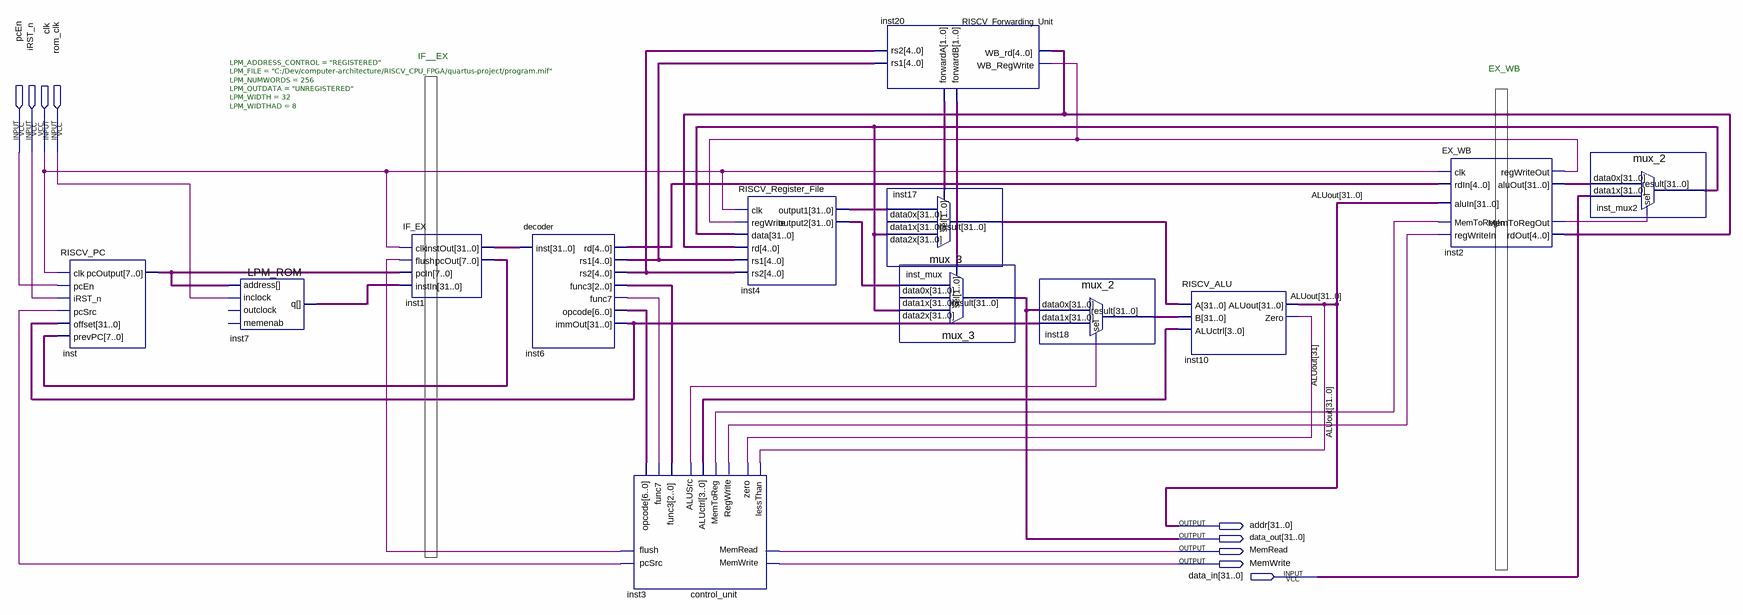
[diagram p0: schematic sheet]
// Quartus schematic CPU_pipelined.bdf as structural Verilog: 13 symbols, 9 pins
module CPU_pipelined (
  input  pcEn,
  input  iRST_n,
  input  clk,
  input  rom_clk,
  input  [31:0] data_in,
  output [31:0] addr,
  output [31:0] data_out,
  output MemRead,
  output MemWrite
);

  wire inst2_memtoregout, inst2_regwriteout, inst3_alusrc, inst3_flush, inst3_memtoreg, inst3_pcsrc,
       inst3_regwrite, inst6_func7, inst10_zero;
  wire [1:0] inst20_forwarda, inst20_forwardb;
  wire [2:0] inst6_func3;
  wire [3:0] inst3_aluctrl;
  wire [4:0] inst2_rdout, inst6_rd, inst6_rs1, inst6_rs2;
  wire [6:0] inst6_opcode;
  wire [7:0] inst1_pcout, inst_pcoutput;
  wire [31:0] inst1_instout, inst2_aluout, inst4_output1, inst4_output2, inst6_immout, inst7_q,
       inst17_result, inst18_result, inst_mux2_result;

  RISCV_PC inst (
    .clk(clk), .iRST_n(iRST_n), .pcSrc(inst3_pcsrc), .pcEn(pcEn), .offset(inst6_immout),
    .prevPC(inst1_pcout), .pcOutput(inst_pcoutput));
  LPM_ROM #(.LPM_ADDRESS_CONTROL("REGISTERED"), .LPM_FILE("C:/Dev/computer-architecture/RISCV_CPU_FPGA/quartus-project/program.mif"), .LPM_NUMWORDS(256), .LPM_OUTDATA("UNREGISTERED"), .LPM_WIDTH(32), .LPM_WIDTHAD(8)) inst7 (
    .address(inst_pcoutput), .inclock(rom_clk), .q(inst7_q));  // open: outclock, memenab
  IF_EX inst1 (
    .clk(clk), .flush(inst3_flush), .pcIn(inst_pcoutput), .instIn(inst7_q), .pcOut(inst1_pcout),
    .instOut(inst1_instout));
  decoder inst6 (
    .inst(inst1_instout), .rd(inst6_rd), .rs1(inst6_rs1), .rs2(inst6_rs2), .func3(inst6_func3),
    .func7(inst6_func7), .immOut(inst6_immout), .opcode(inst6_opcode));
  control_unit inst3 (
    .opcode(inst6_opcode), .func3(inst6_func3), .func7(inst6_func7), .zero(inst10_zero), .lessThan(addr[31]),
    .ALUctrl(inst3_aluctrl), .flush(inst3_flush), .pcSrc(inst3_pcsrc), .ALUSrc(inst3_alusrc),
    .RegWrite(inst3_regwrite), .MemToReg(inst3_memtoreg), .MemRead(MemRead), .MemWrite(MemWrite));
  RISCV_Register_File inst4 (
    .clk(clk), .regWrite(inst2_regwriteout), .data(inst_mux2_result), .rd(inst2_rdout), .rs1(inst6_rs1),
    .rs2(inst6_rs2), .output1(inst4_output1), .output2(inst4_output2));
  RISCV_Forwarding_Unit inst20 (
    .WB_RegWrite(inst2_regwriteout), .WB_rd(inst2_rdout), .rs1(inst6_rs1), .rs2(inst6_rs2),
    .forwardA(inst20_forwarda), .forwardB(inst20_forwardb));
  mux_3 inst17 (
    .data2x(inst_mux2_result), .data0x(inst4_output1), .sel(inst20_forwarda), .result(inst17_result));  // open: data1x
  mux_3 inst_mux (
    .data2x(inst_mux2_result), .data0x(inst4_output2), .sel(inst20_forwardb), .result(data_out));  // open: data1x
  mux_2 inst18 (.data1x(inst6_immout), .data0x(data_out), .sel(inst3_alusrc), .result(inst18_result));
  RISCV_ALU inst10 (.A(inst17_result), .B(inst18_result), .ALUctrl(inst3_aluctrl), .ALUout(addr), .Zero(inst10_zero));
  EX_WB inst2 (
    .regWriteIn(inst3_regwrite), .MemToRegIn(inst3_memtoreg), .clk(clk), .rdIn(inst6_rd), .aluIn(addr),
    .regWriteOut(inst2_regwriteout), .MemToRegOut(inst2_memtoregout), .rdOut(inst2_rdout),
    .aluOut(inst2_aluout));
  mux_2 inst_mux2 (.data1x(data_in), .data0x(inst2_aluout), .sel(inst2_memtoregout), .result(inst_mux2_result));

  // Other names for the same wires on the sheet: ALUout[31:0] = addr

  // Notes on the sheet:
  //   IF__EX
  //   EX_WB
endmodule
